# EAGLE design EBN_GPS_V02 (EAGLE 7.3.0)
CNAME: EasyBoard Nano; CREVISION: 1; DESIGNER: Martin Olejar
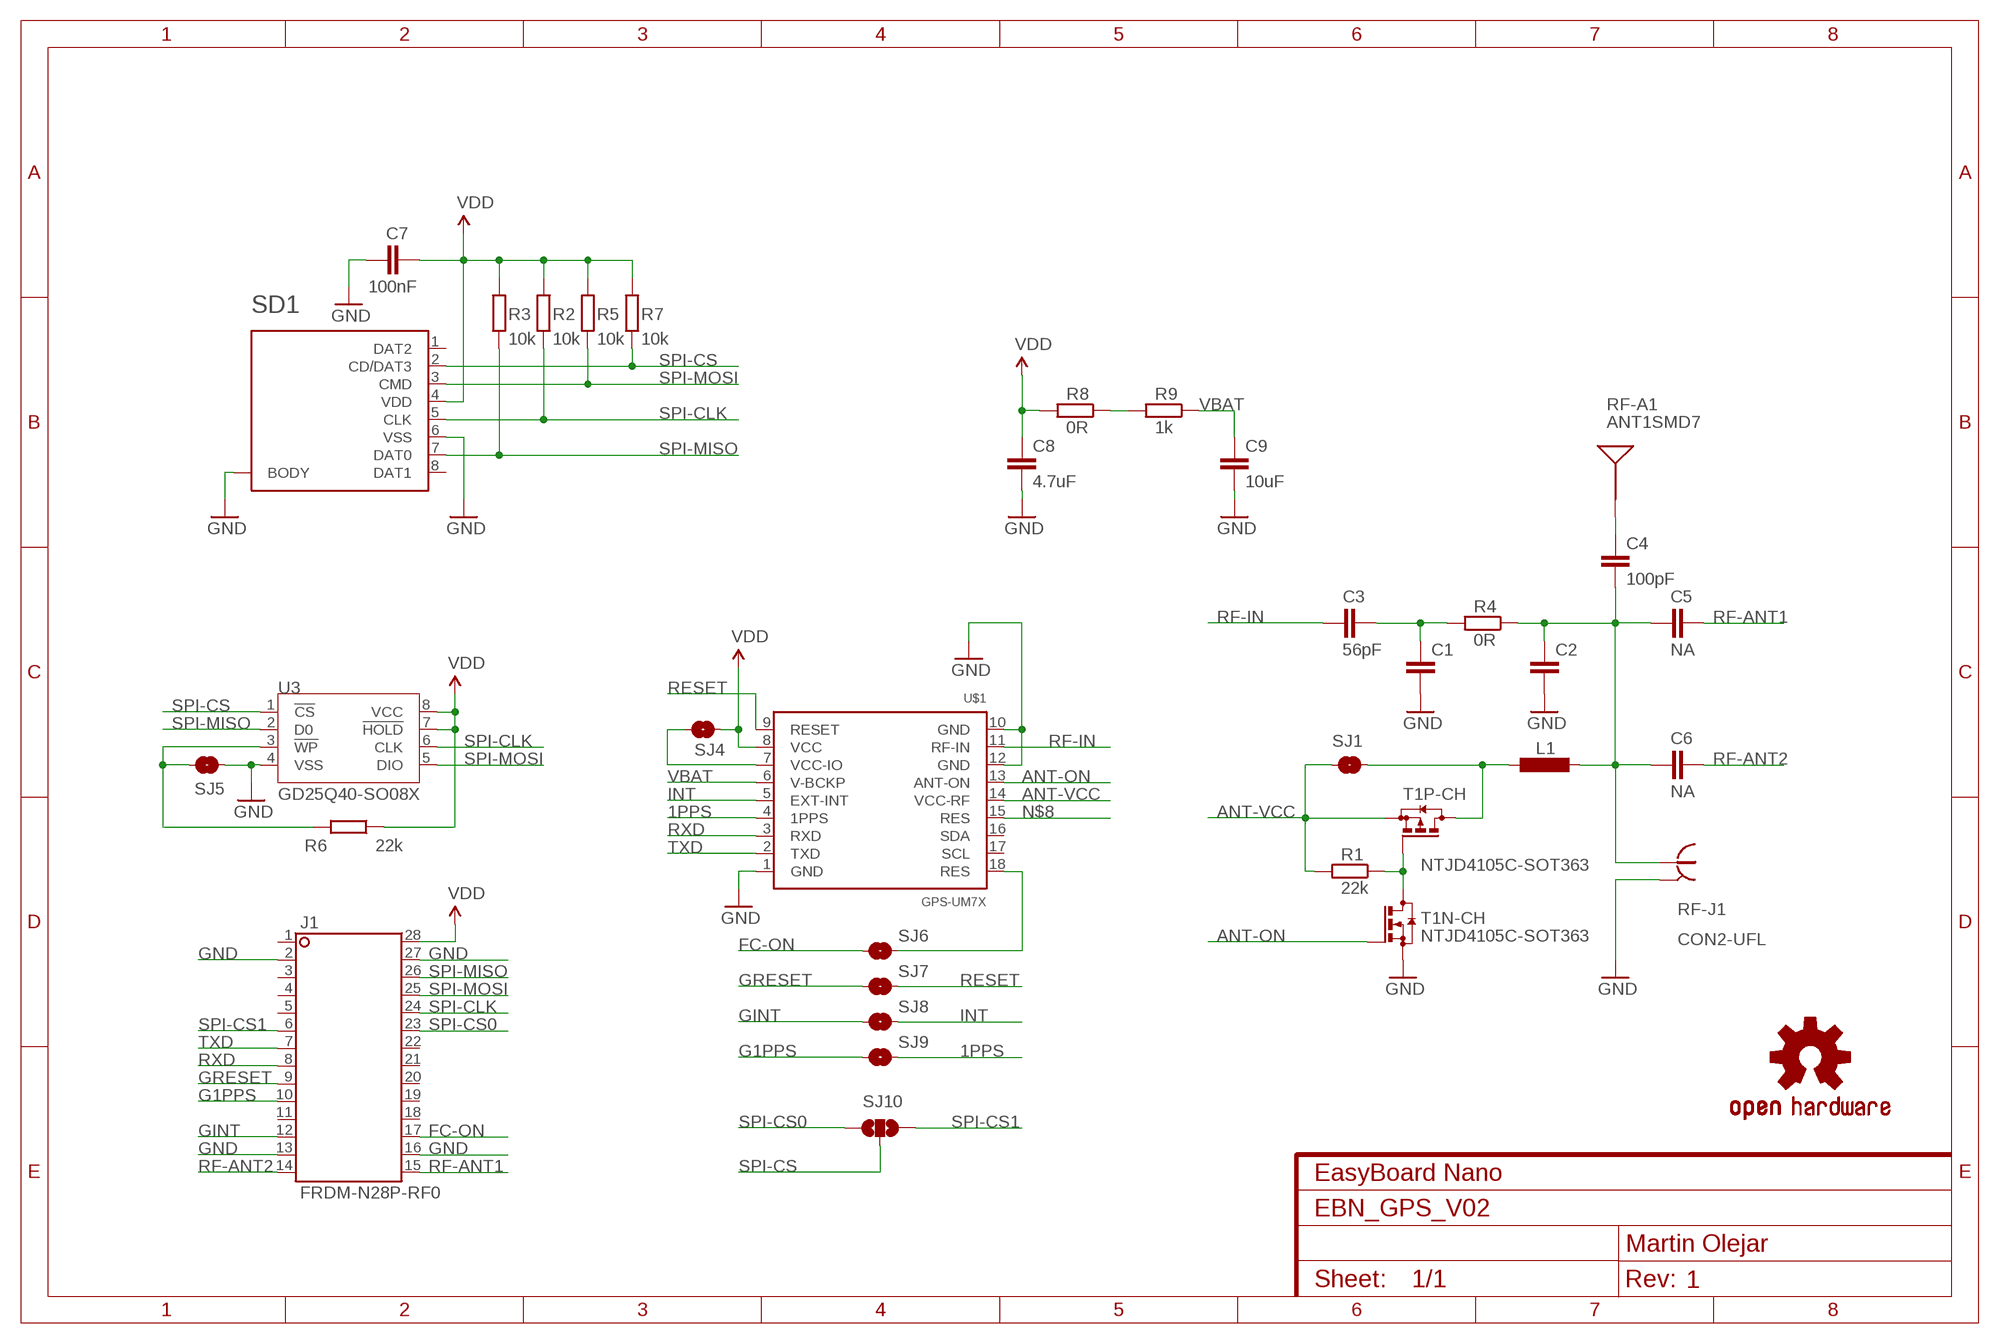
[diagram p0: schematic, sheet 1]

## Parts
C1  C-EUC0402  [C0402]
C2  C-EUC0402  [C0402]
C3  56pF  C-EUC0402  [C0402]
C4  100pF  C-EUC0402  [C0402]
C5  NA  C-EUC0603  [C0603]
C6  NA  C-EUC0603  [C0603]
C7  100nF  C-EUC0402  [C0402]
C8  4.7uF  C-EUC0805  [C0805]
C9  10uF  C-EUC0805  [C0805]
J1  FRDM-N28P-RF0  [EBN-N28P-SHRF0]
L1  L-EUL0603  [L0603]
LOGO1  OSHW-LOGOM  [OSHW-LOGO-M]
R1  22k  R-EUR0402  [R0402]
R2  10k  R-EUR0402  [R0402]
R3  10k  R-EUR0402  [R0402]
R4  0R  R-EUR0402  [R0402]
R5  10k  R-EUR0402  [R0402]
R6  22k  R-EUR0402  [R0402]
R7  10k  R-EUR0402  [R0402]
R8  0R  R-EUR0603  [R0603]
R9  1k  R-EUR0603  [R0603]
RF-A1  ANT1SMD7  [ANT-GPS0]
RF-J1  CON2-UFL  [RF-CON-U.FL]
SD1  SDCARD00  [MICRO-SD-00]
SJ1  SJ-S  [JUMPER-SMD-S1X]
SJ4  SJ-S  [JUMPER-SMD-S1X]
SJ5  SJ-S  [JUMPER-SMD-S1X]
SJ6  SJ-S  [JUMPER-SMD-S1X]
SJ7  SJ-S  [JUMPER-SMD-S1X]
SJ8  SJ-S  [JUMPER-SMD-S1X]
SJ9  SJ-S  [JUMPER-SMD-S1X]
SJ10  SJ2W-S  [JUMPER-SMD-S2X]
T1  NTJD4105C-SOT363  [SOT363]
U3  GD25Q40-SO08X  [SO08X]
U$1  GPS-UM7X  [GPS-XX7X]

## Nets
1PPS: SJ9.2 U$1.4(1PPS)
ANT-ON: T1.2(N-CH:G) U$1.13(ANT-ON)
ANT-VCC: R1.2 SJ1.1 T1.4(P-CH:S) U$1.14(VCC-RF)
FC-ON: J1.17 SJ6.1
G1PPS: J1.10 SJ9.1
GINT: J1.12 SJ8.1
GND: C1.2 C2.2 C7.2 C8.2 C9.2 J1.2 J1.13 J1.16 J1.27 RF-J1.GND@0(GND) RF-J1.GND@1(GND) RF-J1.GND@2(GND) SD1.6(VSS) SD1.SHELD@0(BODY) SD1.SHELD@1(BODY) SJ5.1 T1.1(N-CH:S) U3.4(VSS) U$1.1(GND) U$1.10(GND) U$1.12(GND)
GRESET: J1.9 SJ7.1
INT: SJ8.2 U$1.5(EXT-INT)
N$1: C4.1 RF-A1.SIG
N$2: R8.1 R9.2
N$3: SJ6.2 U$1.18(RES)
N$4: R6.2 SJ5.2 U3.3(!WP)
N$5: SJ4.1 U$1.7(VCC-IO)
N$8: U$1.15(RES)
N$16: R1.1 T1.5(P-CH:G) T1.6(N-CH:D)
N$19: L1.1 SJ1.2 T1.3(P-CH:D)
N$21: C2.1 C4.2 C5.1 C6.1 L1.2 R4.1 RF-J1.SIG
N$22: C1.1 C3.2 R4.2
RESET: SJ7.2 U$1.9(RESET)
RF-ANT1: C5.2 J1.15
RF-ANT2: C6.2 J1.14
RF-IN: C3.1 U$1.11(RF-IN)
RXD: J1.8 U$1.3(RXD)
SPI-CLK: J1.24 R2.1 SD1.5(CLK) U3.6(CLK)
SPI-CS: R7.1 SD1.2(CD/DAT3) SJ10.2 U3.1(!CS)
SPI-CS0: J1.23 SJ10.1
SPI-CS1: J1.6 SJ10.3
SPI-MISO: J1.26 R3.1 SD1.7(DAT0) U3.2(D0)
SPI-MOSI: J1.25 R5.1 SD1.3(CMD) U3.5(DIO)
TXD: J1.7 U$1.2(TXD)
VBAT: C9.1 R9.1 U$1.6(V-BCKP)
VDD: C7.1 C8.1 J1.28 R2.2 R3.2 R5.2 R6.1 R7.2 R8.2 SD1.4(VDD) SJ4.2 U3.7(!HOLD) U3.8(VCC) U$1.8(VCC)
Unconnected: J1.1 J1.3 J1.4 J1.5 J1.11 J1.18 J1.19 J1.20 J1.21 J1.22 SD1.1(DAT2) SD1.8(DAT1) U$1.16(SDA) U$1.17(SCL)

## Library data of the parts
C1-C9 = atomx_RLC:C-EU: CAPACITOR, European symbol
J1 = atomx_Boards:FRDM-N28P: Dual In Line
L1 = atomx_RLC:L-EU: INDUCTOR, European symbol
LOGO1 = atomx_Common:OSHW-LOGO: Open Source Hardware Logo This logo indicates the piece of hardware it is found on incorporates a OSHW license and/or adheres to the definition of open source hardware found here: http://freedomdefined.org/OSHW
R1-R9 = atomx_RLC:R-EU: RESISTOR, European symbol
RF-A1 = atomx_RF-Ant:ANT1: Chip antenna Single endded antenna. Common with smaller chip antennas. CHIP4 package is the GPS Chip Antenna SKU: GPS-08418. CHIP5 package is 2.4GHz chip antenna SKU: WRL-00144.
RF-J1 = atomx_RF-Ant:CON2
SD1 = atomx_Connectors:SDCARD
SJ1 SJ4-SJ9 = atomx_Connectors:SJ: SMD solder JUMPER
SJ10 = atomx_Connectors:SJ2W: SMD solder JUMPER
T1 = atomx_DiscreteSemi:NTJD4105C
U3 = atomx_IC:GD25Q40: SPI Flash 4Mbit (512kB)
U$1 = atomx_RF-Modules:GPS-UM7X

## Board
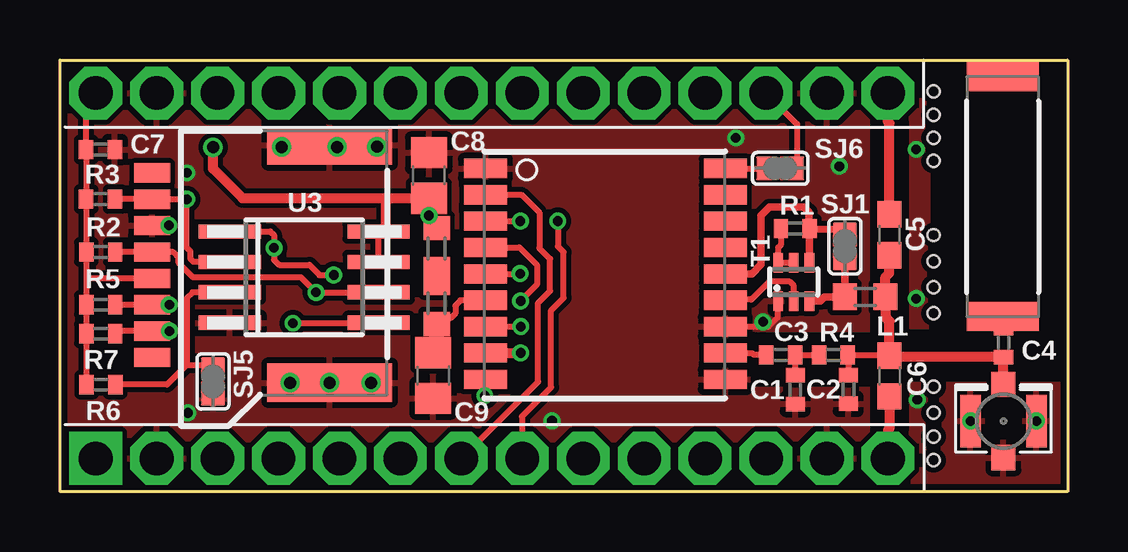
[diagram p1: board, top side]
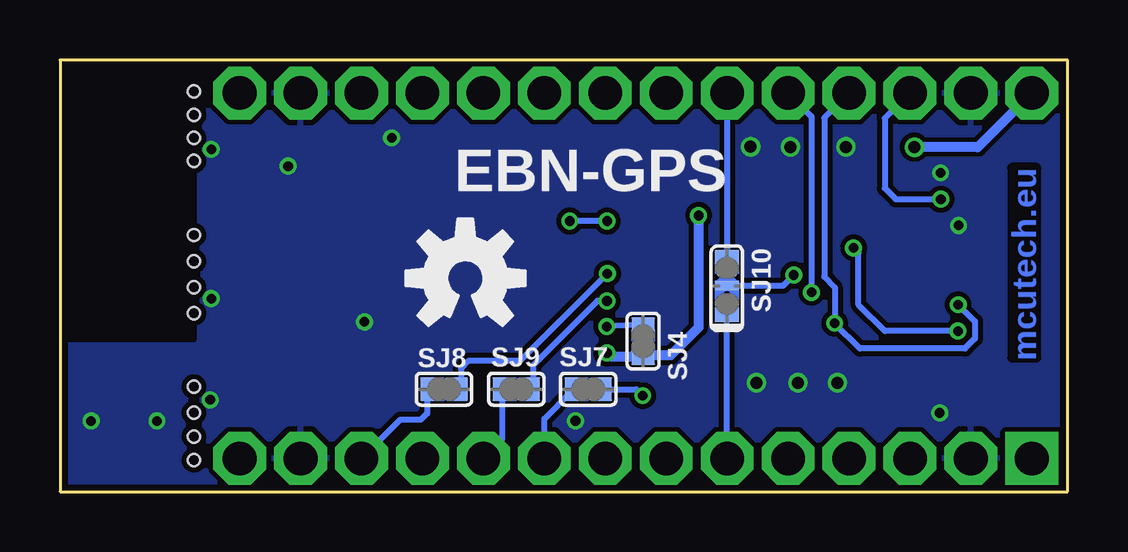
[diagram p2: board, bottom side, seen from below]

Size 42 x 18 mm. Coordinates in mm from the lower left corner, seen from the top.
Copper layers (1*16): Top 0.035mm / dielectric 1.5mm / Bottom 0.035mm
Design rules "ITEADstudio_DRC *": minimum track width 6mil, minimum drill 12mil, track to track 8mil, track to pad 8mil, pad to pad 8mil, via to via 8mil, smd to smd 0mil, copper to edge 10mil, drill to drill 10mil, minimum pad ring 10mil, minimum via ring 6mil, stop-mask expansion 2mil, vias tented up to drill 100mil, thermal gap 10mil

### Footprints (pad centres in the part's own frame; a part is rotated, then mirrored left to right if it is on the bottom)
C0402 = smd 0.6 x 0.8: 1 -0.6,0; 2 0.6,0
C0603 = smd 1.1 x 1: 1 -0.85,0; 2 0.85,0
C0805 = smd 1.3 x 1.5: 1 -0.95,0; 2 0.95,0
EBN-N28P-SHRF0 = drill 1.4 pad 2.2 square: 1 -16.51,-7.62 | drill 1.4 pad 2.2 octagon: 2 -13.97,-7.62; 3 -11.43,-7.62; 4 -8.89,-7.62; 5 -6.35,-7.62; 6 -3.81,-7.62; 7 -1.27,-7.62; 8 1.27,-7.62; 9 3.81,-7.62; 10 6.35,-7.62; 11 8.89,-7.62; 12 11.43,-7.62; 13 13.97,-7.62; 14 16.51,-7.62; 15 16.51,7.62; 16 13.97,7.62; 17 11.43,7.62; 18 8.89,7.62; 19 6.35,7.62; 20 3.81,7.62; 21 1.27,7.62; 22 -1.27,7.62; 23 -3.81,7.62; 24 -6.35,7.62; 25 -8.89,7.62; 26 -11.43,7.62; 27 -13.97,7.62; 28 -16.51,7.62 | hole 0.5: 18.415,7.693; 18.415,6.704; 18.415,-7.693; 18.415,-6.704; 18.415,-5.715; 18.415,-1.57; 18.415,-0.481; 18.415,0.608; 18.415,4.786; 18.415,1.697; 18.415,5.745; 18.415,-4.626
L0603 = smd 1 x 1.1: 1 -0.85,0; 2 0.85,0
R0402 = smd 0.6 x 0.8: 1 -0.6,0; 2 0.6,0
R0603 = smd 1 x 1.1: 1 -0.85,0; 2 0.85,0
ANT-GPS0 = smd 1.2 x 3: NC 5,0; SIG -5,0
RF-CON-U.FL = smd 1.05 x 1: GND@0 -1.525,0; SIG 1.525,0 | smd 2.2 x 0.85: GND@1 0,1.375; GND@2 0,-1.375
MICRO-SD-00 = smd 0.8 x 1.5: 1 3.85,-5; 2 2.75,-5; 3 1.65,-5; 4 0.55,-5; 5 -0.55,-5; 6 -1.65,-5; 7 -2.75,-5; 8 -3.85,-5 | smd 1.6 x 5.2: SHELD@0 -5,2.4; SHELD@1 4.9,2.4
JUMPER-SMD-S1X = smd 0.6 x 1: 1 -0.7,0; 2 0.7,0
JUMPER-SMD-S2X = smd 0.6 x 1: 1 -1.2,0; 3 1.2,0 | smd 0.4 x 1: 2 0,0
SOT363 = smd 0.4 x 0.8: 1 -0.65,-0.8; 2 0,-0.8; 3 0.65,-0.8; 4 0.65,0.8; 5 0,0.8; 6 -0.65,0.8
SO08X = smd 0.6 x 2.6: 1 -1.905,-3.1; 2 -0.635,-3.1; 3 0.635,-3.1; 4 1.905,-3.1; 5 1.905,3.1; 6 0.635,3.1; 7 -0.635,3.1; 8 -1.905,3.1
GPS-XX7X = smd 1.8 x 0.8: 1 -4.906,4.378; 2 -4.906,3.277; 3 -4.906,2.178; 4 -4.906,1.077; 5 -4.906,-0.022; 6 -4.906,-1.123; 7 -4.906,-2.223; 8 -4.906,-3.322; 9 -4.906,-4.423; 10 5.094,-4.423; 11 5.094,-3.322; 12 5.094,-2.223; 13 5.094,-1.123; 14 5.094,-0.022; 15 5.094,1.077; 16 5.094,2.178; 17 5.094,3.277; 18 5.094,4.378

### Placement (x,y rotation side)
C1  30.65,4.25 270 top
C2  32.86,4.26 270 top
C3  30.04,5.7 0 top
C4  39.33,6.21 270 top
C5  34.58,10.71 90 top
C6  34.58,4.82 270 top
C7  1.69,14.26 0 top
C8  15.38,13.18 90 top
C9  15.56,4.84 270 top
J1  18,9 0 top
L1  33.56,8.12 0 top
LOGO1  25.1,8.89 0 bottom
R1  30.65,10.97 0 top
R2  1.7,9.99 180 top
R3  1.69,12.2 180 top
R4  32.24,5.7 180 top
R5  1.7,7.79 180 top
R6  1.71,4.46 0 top
R7  1.7,6.58 180 top
R8  15.7,10.14 90 top
R9  15.7,7.85 90 top
RF-A1  39.3,12.3 90 top
RF-J1  39.33,2.94 90 top
SD1  8.84,9.44 270 top
SJ1  32.72,10.23 270 top
SJ4  17.69,6.27 270 bottom
SJ5  6.38,4.59 90 top
SJ6  30.02,13.48 180 top
SJ7  19.98,4.27 0 bottom
SJ8  25.99,4.27 0 bottom
SJ9  22.98,4.27 0 bottom
SJ10  14.2,8.58 270 bottom
T1  30.59,8.74 0 top
U3  10.18,8.94 270 top
U$1  22.64,9.1 0 top

### Tracks (layer width: path | path; a pad name or v marks a point on that pad's centre or on a via)
1PPS  (via drill 0.4)
  Top 0.254: U$1.4 19.15,10.18 19.88,9.45 19.88,8.63 v19.2,7.95
  Bottom 0.254: 22.39,4.28 SJ9.2 22.28,5.27 19.6,7.95 v19.2,7.95
ANT-ON
  Top 0.254: T1.2 30.59,8.59 30.42,8.76 29.57,8.76 28.82,8.01 27.77,8.01 U$1.13
ANT-VCC
  Top 0.254: 31.28,10.94 R1.2 | R1.2 | 31.22,11 R1.2
  Top 0.305: SJ1.1 31.28,10.94 | T1.4 R1.2 | U$1.14 28.84,9.08 29.22,9.46 29.22,11.51 29.57,11.86 31.02,11.86 31.22,11.66 31.22,11
FC-ON
  Top 0.254: J1.17 30.72,15.33 SJ6.1
G1PPS
  Bottom 0.254: J1.10 23.58,2.15 23.58,4.17 arc-90 SJ9.1
GINT
  Bottom 0.254: J1.12 27.82,2.99 26.96,2.99 26.69,3.26 SJ8.1
GND  (via drill 0.4, 0.5)
  Top 0.254: U$1.12 29.54,6.88 29.92,7.26 29.92,7.92 T1.1
  other vias: 35.74,3.83 35.69,8.05 35.69,14.27 28.17,14.75 32.49,13.57 29.31,7.08 13.21,14.38 11.55,14.37 20.51,2.95 9.24,14.37 4.54,11.1 5.29,13.29 9.59,4.54 11.24,4.54 5.33,3.28 37.96,2.94 40.7,2.94 12.97,4.54
  pour Top: 0.01,17.99 41.99,17.99 41.99,0.02 0.01,0.02
  pour Bottom: 0.01,17.99 41.99,17.99 41.99,0.02 0.01,0.02
GRESET
  Bottom 0.254: J1.9 21.81,3.04 20.68,4.17 SJ7.1
INT  (via drill 0.4)
  Top 0.254: U$1.5 19.17,9.08 v19.18,9.09
  Bottom 0.254: 25.38,4.28 SJ8.2 | 25.4,4.28 SJ8.2 | v19.18,9.09 22.82,5.45 24.96,5.45 25.29,5.12 SJ8.2
N$1
  Top 0.254: 40.53,7.24 RF-A1.SIG
  Top 0.406: C4.1 40.53,7.24
N$2
  Top 0.254: 15.7,9.53 R8.1 R9.2
N$3
  Top 0.254: U$1.18 29.34,13.48 SJ6.2
N$4
  Top 0.254: U3.3 5.53,8.3 5.29,8.07 5.29,5.29 | 6.46,5.3 SJ5.2 5.29,5.29 | 5.29,5.29 4.46,4.46 R6.2
N$5  (via drill 0.4)
  Top 0.254: U$1.7 v19.21,6.88
  Bottom 0.254: SJ4.1 v19.21,6.88
N$6
  cutout Top: 41.99,18 36.41,18 36.41,6.12 41.99,6.12
N$10
  cutout Bottom: 36.41,18 41.99,18 41.99,6.36 36.41,6.36
N$11
  cutout Top (isolate 0.254): 33.9,15.44 35.25,15.44 35.25,2.55 33.9,2.55
N$12
  cutout Top (isolate 0.254): 42,6.63 35.24,6.63 35.25,4.71 42.01,4.71
N$13
  cutout Top (isolate 0.254): 28.91,6.54 33.92,6.54 33.93,4.49 28.92,4.49
N$16
  Top 0.254: T1.5 T1.6 29.94,10.18 30.07,10.31 30.07,10.95 R1.1
N$19
  Top 0.254: L1.1 | 32.71,9.72 SJ1.2
  Top 0.305: T1.3 31.7,7.94 31.87,8.11 L1.1 | L1.1 32.71,9.72
N$21
  Top 0.254: C6.1 34.58,5.7 R4.1 32.86,5.7 C2.1
  Top 0.406: C5.1 34.57,9.9 34.57,9.11 34.41,8.95 L1.2 34.42,7.26 34.58,7.1 C6.1 34.58,5.61 C4.2 RF-J1.SIG
N$22
  Top 0.254: R4.2 C3.2 C1.1
RESET  (via drill 0.4)
  Top 0.254: U$1.9 17.71,4.65 v17.71,4
  Bottom 0.254: SJ7.2 17.98,4.27 v17.71,4
RF-ANT1
  Top 0.406: C5.2 34.58,15.35 34.52,15.41 J1.15
RF-ANT2
  Top 0.406: C6.2 34.58,2.65 34.52,2.56 J1.14
RF-IN
  Top 0.254: U$1.11 28.85,5.78 28.92,5.71 C3.1
RXD  (via drill 0.4)
  Top 0.254: U$1.3 v19.19,11.28 | J1.8 19.25,1.4 19.25,3.13 20.47,4.35 20.47,7.56 20.99,8.08 20.99,9.98 20.75,10.22 v20.75,11.28
  Bottom 0.254: v19.19,11.28 v20.75,11.28
SPI-CLK  (via drill 0.4)
  Top 0.254: U3.6 13.51,8.31 v10.67,8.31 10.05,8.93 8.62,8.93 5.55,8.93 4.95,9.53 4.95,9.75 4.72,9.98 SD1.5 | SD1.5 | SD1.5 R2.1
  Bottom 0.254: J1.24 10.67,15.64 v10.67,8.31
SPI-CS  (via drill 0.4)
  Top 0.254: U3.1 6.86,10.85 8.77,10.85 8.92,10.7 v8.92,10.16 8.92,9.66 9.13,9.45 10.4,9.45 10.82,9.03 v11.41,9.03 | v4.57,6.69 SD1.2 2.41,6.69 R7.1
  Bottom 0.254: SJ10.2 11.86,8.58 v11.41,9.03 | v4.57,6.69 7.61,6.69 8.71,7.79 8.71,9.95 v8.92,10.16
SPI-CS0
  Bottom 0.254: J1.23 SJ10.1
SPI-CS1
  Bottom 0.254: J1.6 SJ10.3
SPI-MISO  (via drill 0.4)
  Top 0.254: U3.2 5.57,9.57 5.44,9.7 5.44,10.02 5.28,10.18 v5.28,12.19 SD1.7 R3.1
  Bottom 0.254: J1.26 7.62,15.57 7.62,12.65 7.16,12.19 v5.28,12.19
SPI-MOSI  (via drill 0.4)
  Top 0.254: U3.5 13.49,7.02 v9.71,7.02 | v4.56,7.79 SD1.3 R5.1
  Bottom 0.254: J1.25 10.14,15.59 10.14,8.96 9.7,8.52 v9.7,7.03 v9.71,7.02 8.65,5.96 4.28,5.96 3.86,6.38 3.86,7.1 v4.55,7.79 v4.56,7.79
TXD
  Top 0.254: J1.7 19.93,4.58 19.93,7.87 20.43,8.37 20.43,9.7 19.97,10.16 19.98,10.17 19.98,11.63 19.23,12.38 U$1.2
VBAT
  Top 0.254: C9.1 15.7,5.93 | U$1.6 16.7,7.98 16.48,7.76 16.48,7.43 16.3,7.25 R9.1
  Top 0.61: 15.7,5.93 R9.1
VDD  (via drill 0.4, 0.5)  (1 unrouted)
  Top 0.254: U3.7 U3.8 | J1.28 1.1,16.23 C7.1 R3.2 R2.2 1.1,8.84 | R6.1 R7.2 R5.2 1.1,8.84 | SD1.4 1.15,8.89 1.1,8.84 | v19.2,5.78 | v15.38,11.51 15.71,11.18 R8.2
  Top 0.406: v6.38,14.36 6.38,13.46 7.61,12.23 13.6,12.23 | 13.6,12.23 C8.1 | U3.8 13.6,10.94 13.6,12.23 | U$1.8 v19.2,5.78
  Top 0.61: C8.1 v15.38,11.51
  Bottom 0.406: J1.28 3.75,14.36 v6.38,14.36 | v15.38,11.51 15.38,6.85 16.55,5.68 17.68,5.68 SJ4.2 | v19.2,5.78 19.06,5.64 18.04,5.64

### Text on the board
Bottom: mcutech.eu
bPlace: EBN-GPS